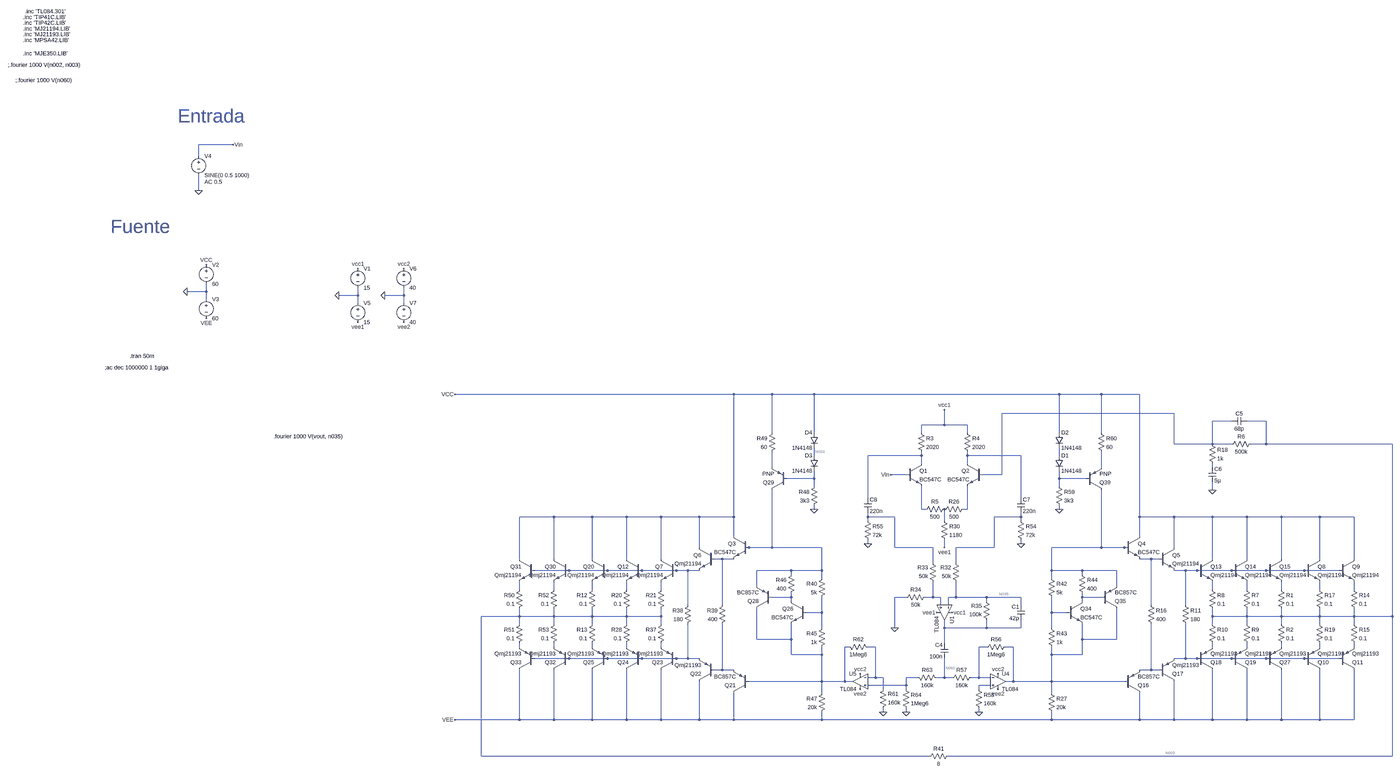
[diagram p0: schematic V4.asc, whole sheet]
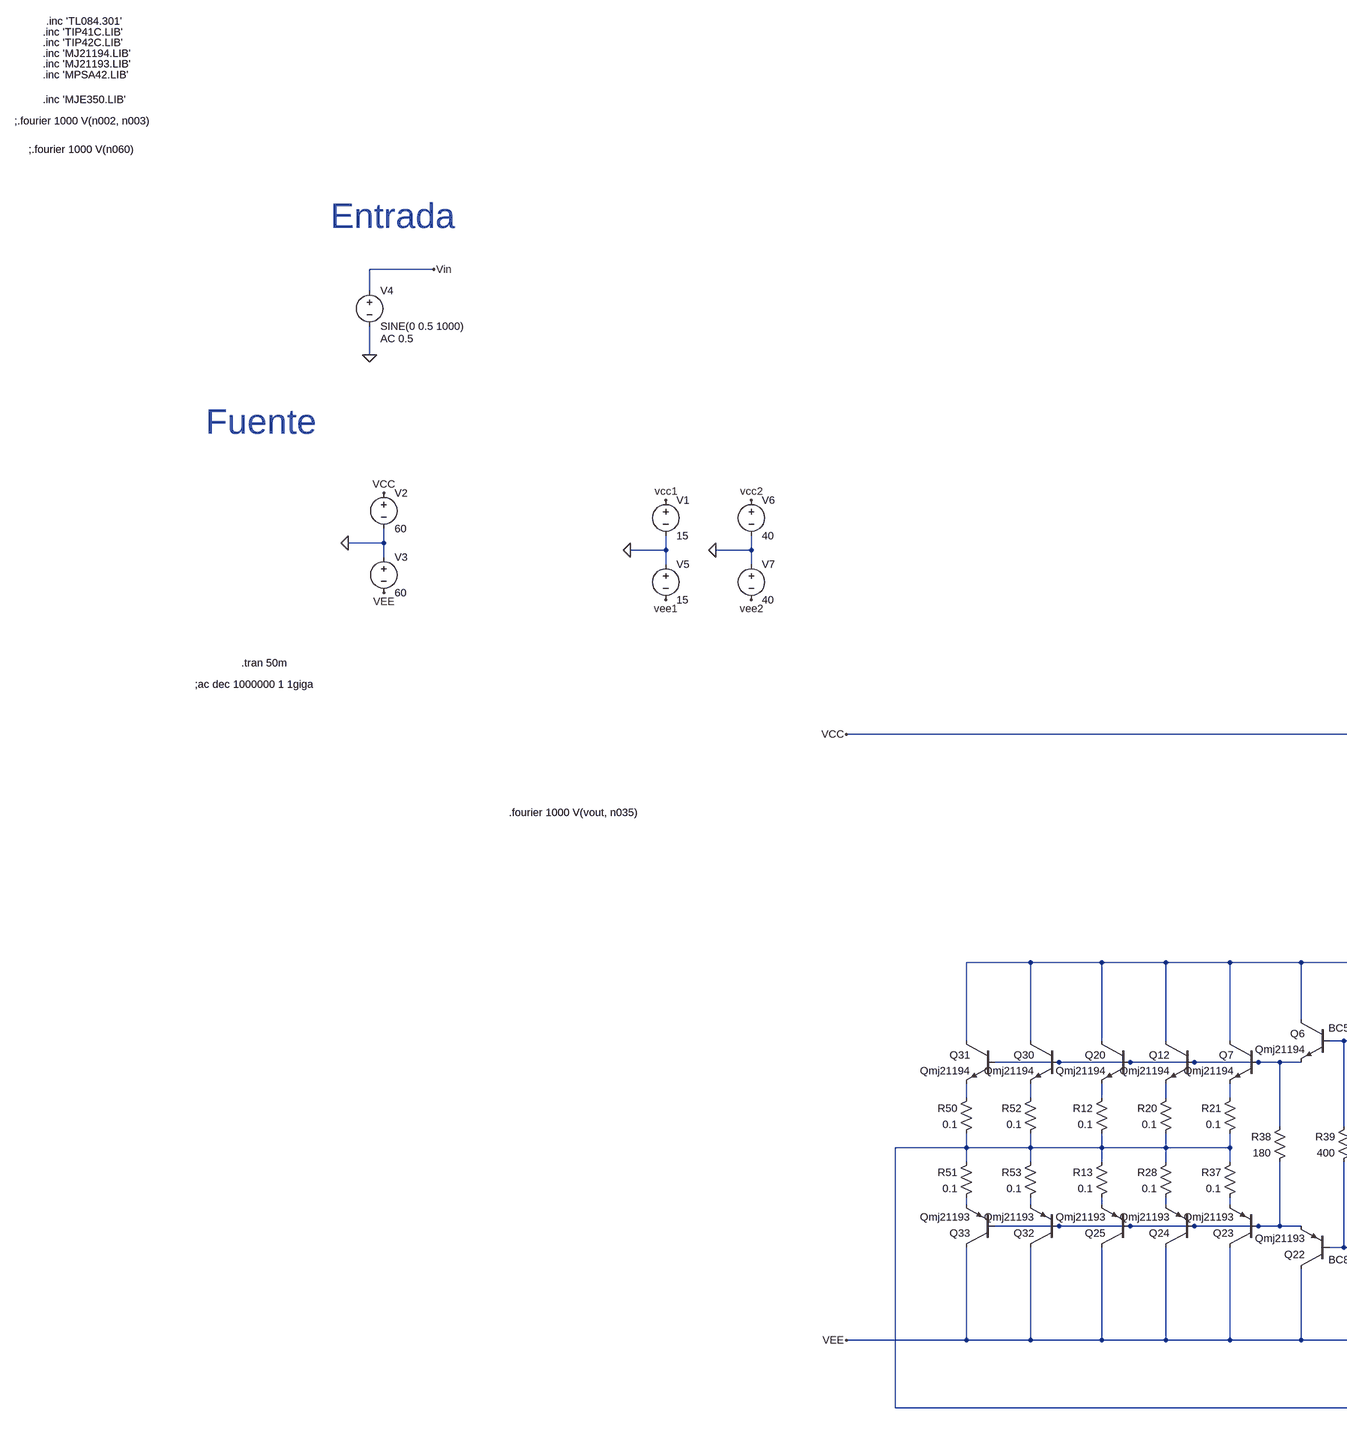
[diagram p1: schematic V4.asc, part, row 1 of 1, column 1 of 2]
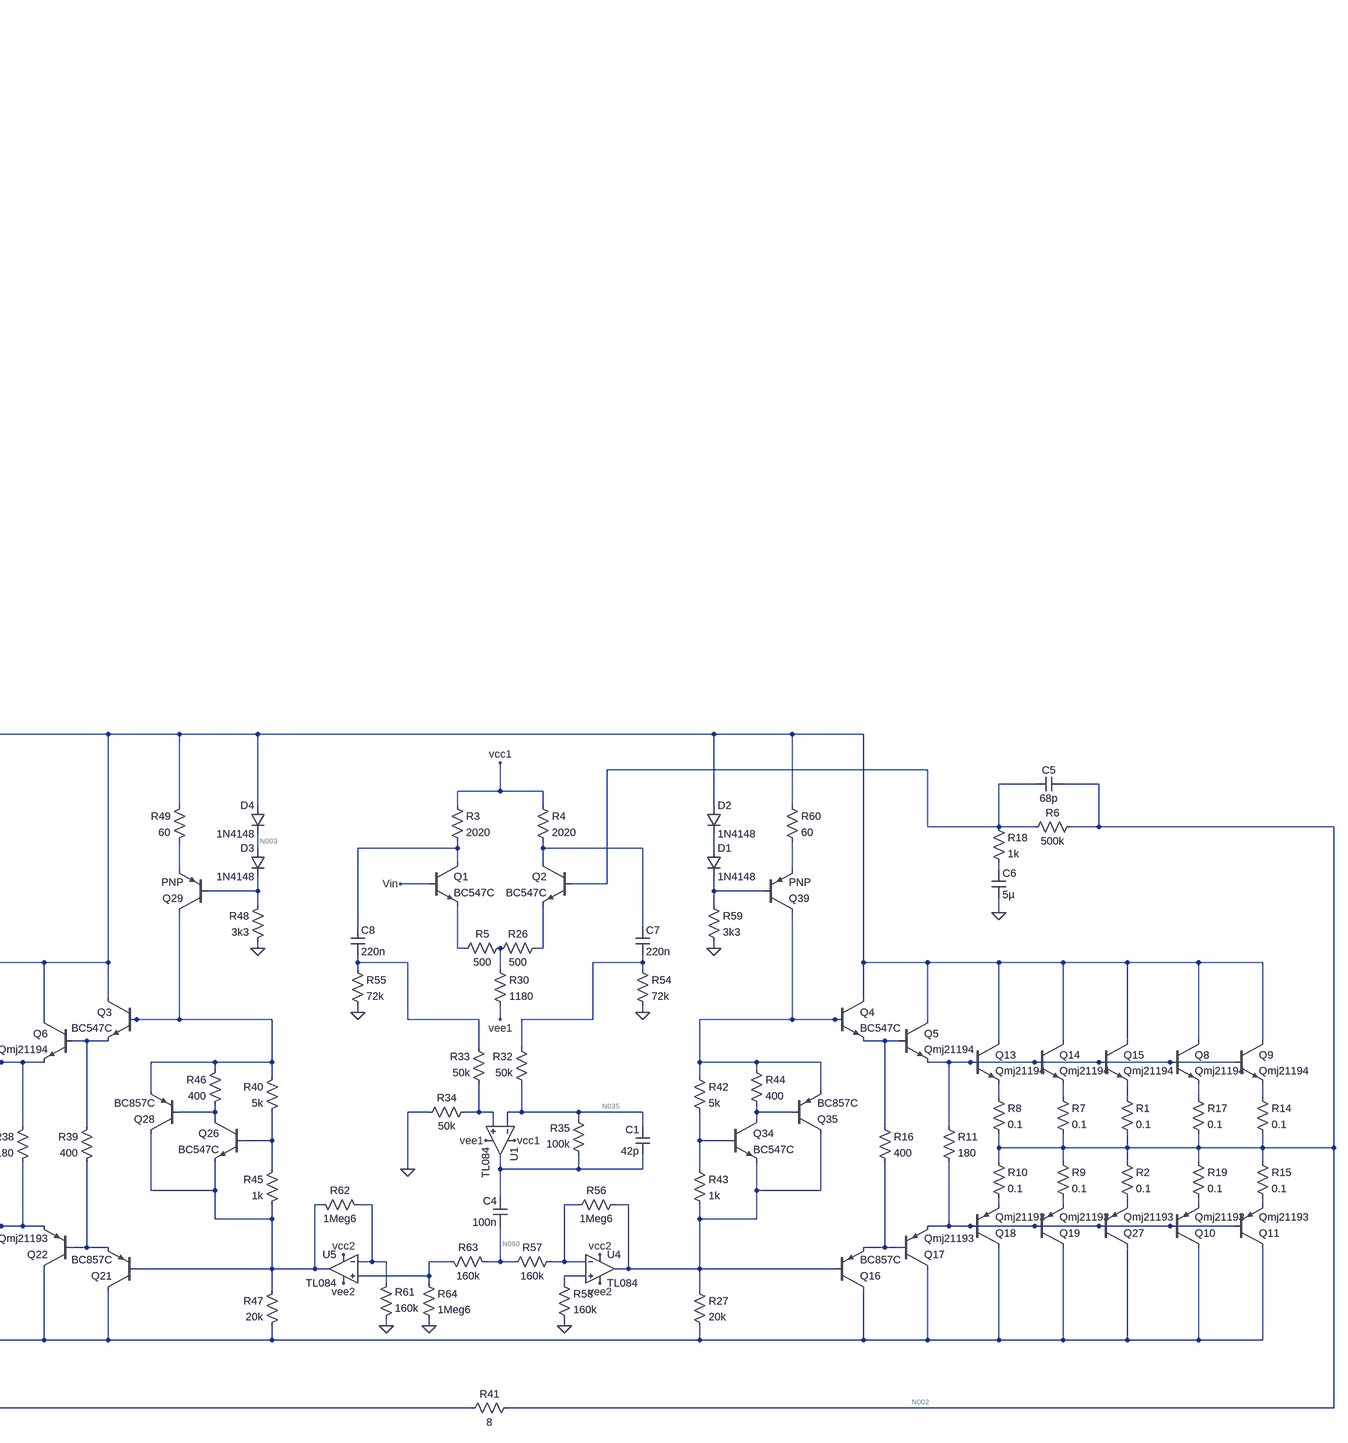
[diagram p2: schematic V4.asc, part, row 1 of 1, column 2 of 2]
V4.asc, the LTspice schematic file:
Version 4
SHEET 1 11584 4036
WIRE 3760 -64 3616 -64
WIRE 3616 -16 3616 -64
WIRE 3616 128 3616 64
WIRE 3648 1200 3648 1168
WIRE 3648 1200 3568 1200
WIRE 4288 1216 4288 1184
WIRE 4288 1216 4208 1216
WIRE 4480 1216 4480 1184
WIRE 4480 1216 4400 1216
WIRE 3648 1232 3648 1200
WIRE 4288 1248 4288 1216
WIRE 4480 1248 4480 1216
WIRE 6832 2000 5648 2000
WIRE 6992 2000 6832 2000
WIRE 7168 2000 6992 2000
WIRE 8192 2000 7168 2000
WIRE 8368 2000 8192 2000
WIRE 8528 2000 8368 2000
WIRE 8672 2080 7952 2080
WIRE 8912 2112 8832 2112
WIRE 9056 2112 8976 2112
WIRE 7712 2128 7712 2064
WIRE 7712 2128 7616 2128
WIRE 7808 2128 7712 2128
WIRE 6992 2160 6992 2000
WIRE 7168 2160 7168 2000
WIRE 7616 2160 7616 2128
WIRE 7808 2160 7808 2128
WIRE 8192 2160 8192 2000
WIRE 8368 2160 8368 2000
WIRE 8672 2208 8672 2080
WIRE 8832 2208 8832 2112
WIRE 8832 2208 8672 2208
WIRE 8912 2208 8832 2208
WIRE 9056 2208 9056 2112
WIRE 9056 2208 8992 2208
WIRE 9584 2208 9056 2208
WIRE 7168 2256 7168 2224
WIRE 7616 2256 7616 2240
WIRE 7616 2256 7392 2256
WIRE 7808 2256 7808 2240
WIRE 8032 2256 7808 2256
WIRE 8192 2256 8192 2224
WIRE 7616 2288 7616 2256
WIRE 7808 2288 7808 2256
WIRE 6992 2304 6992 2240
WIRE 8368 2304 8368 2240
WIRE 8832 2304 8832 2288
WIRE 7552 2336 7488 2336
WIRE 7952 2336 7952 2080
WIRE 7952 2336 7872 2336
WIRE 7168 2352 7168 2320
WIRE 7168 2352 7056 2352
WIRE 8192 2352 8192 2320
WIRE 8304 2352 8192 2352
WIRE 7168 2384 7168 2352
WIRE 8192 2384 8192 2352
WIRE 8832 2400 8832 2368
WIRE 7392 2432 7392 2256
WIRE 8032 2432 8032 2256
WIRE 7168 2480 7168 2464
WIRE 7616 2480 7616 2384
WIRE 7632 2480 7616 2480
WIRE 7808 2480 7808 2384
WIRE 7808 2480 7792 2480
WIRE 8192 2480 8192 2464
WIRE 6080 2512 5936 2512
WIRE 6240 2512 6080 2512
WIRE 6384 2512 6240 2512
WIRE 6528 2512 6384 2512
WIRE 6688 2512 6528 2512
WIRE 6832 2512 6832 2000
WIRE 6832 2512 6688 2512
WIRE 7392 2512 7392 2496
WIRE 7504 2512 7392 2512
WIRE 8032 2512 8032 2496
WIRE 8032 2512 7920 2512
WIRE 8528 2512 8528 2000
WIRE 8672 2512 8528 2512
WIRE 8832 2512 8672 2512
WIRE 8976 2512 8832 2512
WIRE 9120 2512 8976 2512
WIRE 9280 2512 9120 2512
WIRE 9424 2512 9280 2512
WIRE 7392 2528 7392 2512
WIRE 7712 2528 7712 2480
WIRE 8032 2528 8032 2512
WIRE 6832 2592 6832 2512
WIRE 8528 2592 8528 2512
WIRE 7392 2624 7392 2608
WIRE 8032 2624 8032 2608
WIRE 6688 2640 6688 2512
WIRE 6896 2640 6880 2640
WIRE 6992 2640 6992 2400
WIRE 6992 2640 6896 2640
WIRE 7200 2640 6992 2640
WIRE 7504 2640 7504 2512
WIRE 7664 2640 7504 2640
WIRE 7712 2640 7712 2608
WIRE 7920 2640 7920 2512
WIRE 7920 2640 7760 2640
WIRE 8368 2640 8368 2400
WIRE 8368 2640 8160 2640
WIRE 8464 2640 8368 2640
WIRE 8480 2640 8464 2640
WIRE 8672 2640 8672 2512
WIRE 5936 2688 5936 2512
WIRE 6080 2688 6080 2512
WIRE 6240 2688 6240 2512
WIRE 6384 2688 6384 2512
WIRE 6528 2688 6528 2512
WIRE 6784 2688 6752 2688
WIRE 6832 2688 6784 2688
WIRE 8576 2688 8528 2688
WIRE 8608 2688 8576 2688
WIRE 8832 2688 8832 2512
WIRE 8976 2688 8976 2512
WIRE 9120 2688 9120 2512
WIRE 9280 2688 9280 2512
WIRE 9424 2688 9424 2512
WIRE 7664 2704 7664 2640
WIRE 7760 2704 7760 2640
WIRE 6144 2736 6000 2736
WIRE 6304 2736 6144 2736
WIRE 6448 2736 6304 2736
WIRE 6592 2736 6448 2736
WIRE 6640 2736 6592 2736
WIRE 6688 2736 6640 2736
WIRE 7072 2736 6928 2736
WIRE 7200 2736 7200 2640
WIRE 7200 2736 7072 2736
WIRE 8160 2736 8160 2640
WIRE 8288 2736 8160 2736
WIRE 8432 2736 8288 2736
WIRE 8720 2736 8672 2736
WIRE 8768 2736 8720 2736
WIRE 8912 2736 8768 2736
WIRE 9056 2736 8912 2736
WIRE 9216 2736 9056 2736
WIRE 9360 2736 9216 2736
WIRE 7072 2752 7072 2736
WIRE 8288 2752 8288 2736
WIRE 7200 2768 7200 2736
WIRE 8160 2768 8160 2736
WIRE 6928 2800 6928 2736
WIRE 8432 2800 8432 2736
WIRE 5936 2816 5936 2784
WIRE 6080 2816 6080 2784
WIRE 6240 2816 6240 2784
WIRE 6384 2816 6384 2784
WIRE 6528 2816 6528 2784
WIRE 8832 2816 8832 2784
WIRE 8976 2816 8976 2784
WIRE 9120 2816 9120 2784
WIRE 9280 2816 9280 2784
WIRE 9424 2816 9424 2784
WIRE 7072 2848 7072 2832
WIRE 7072 2848 6992 2848
WIRE 7552 2848 7504 2848
WIRE 7664 2848 7664 2784
WIRE 7664 2848 7632 2848
WIRE 7696 2848 7664 2848
WIRE 7760 2848 7760 2784
WIRE 7760 2848 7728 2848
WIRE 7888 2848 7760 2848
WIRE 8032 2848 7888 2848
WIRE 8288 2848 8288 2832
WIRE 8368 2848 8288 2848
WIRE 7072 2864 7072 2848
WIRE 7888 2864 7888 2848
WIRE 8288 2864 8288 2848
WIRE 6640 2880 6640 2736
WIRE 6784 2880 6784 2688
WIRE 7696 2880 7696 2848
WIRE 7728 2880 7728 2848
WIRE 8032 2880 8032 2848
WIRE 8576 2880 8576 2688
WIRE 8720 2880 8720 2736
WIRE 7200 2912 7200 2848
WIRE 7200 2912 7136 2912
WIRE 8160 2912 8160 2848
WIRE 8224 2912 8160 2912
WIRE 5936 2928 5936 2896
WIRE 5936 2928 5776 2928
WIRE 6080 2928 6080 2896
WIRE 6080 2928 5936 2928
WIRE 6240 2928 6240 2896
WIRE 6240 2928 6080 2928
WIRE 6384 2928 6384 2896
WIRE 6384 2928 6240 2928
WIRE 6528 2928 6528 2896
WIRE 6528 2928 6384 2928
WIRE 8832 2928 8832 2896
WIRE 8976 2928 8976 2896
WIRE 8976 2928 8832 2928
WIRE 9120 2928 9120 2896
WIRE 9120 2928 8976 2928
WIRE 9280 2928 9280 2896
WIRE 9280 2928 9120 2928
WIRE 9424 2928 9424 2896
WIRE 9424 2928 9280 2928
WIRE 9584 2928 9584 2208
WIRE 9584 2928 9424 2928
WIRE 5936 2960 5936 2928
WIRE 6080 2960 6080 2928
WIRE 6240 2960 6240 2928
WIRE 6384 2960 6384 2928
WIRE 6528 2960 6528 2928
WIRE 8832 2960 8832 2928
WIRE 8976 2960 8976 2928
WIRE 9120 2960 9120 2928
WIRE 9280 2960 9280 2928
WIRE 9424 2960 9424 2928
WIRE 7200 2976 7200 2912
WIRE 7504 2976 7504 2848
WIRE 7712 2976 7712 2944
WIRE 7888 2976 7888 2944
WIRE 7888 2976 7712 2976
WIRE 8032 2976 8032 2944
WIRE 8032 2976 7888 2976
WIRE 8160 2976 8160 2912
WIRE 6928 3024 6928 2896
WIRE 7072 3024 7072 2960
WIRE 7072 3024 6928 3024
WIRE 8288 3024 8288 2960
WIRE 8432 3024 8432 2896
WIRE 8432 3024 8288 3024
WIRE 7712 3040 7712 2976
WIRE 5936 3056 5936 3040
WIRE 6080 3056 6080 3040
WIRE 6240 3056 6240 3040
WIRE 6384 3056 6384 3040
WIRE 6528 3056 6528 3040
WIRE 7312 3056 7296 3056
WIRE 7424 3056 7392 3056
WIRE 7888 3056 7856 3056
WIRE 8000 3056 7968 3056
WIRE 8832 3056 8832 3040
WIRE 8976 3056 8976 3040
WIRE 9120 3056 9120 3040
WIRE 9280 3056 9280 3040
WIRE 9424 3056 9424 3040
WIRE 7072 3088 7072 3024
WIRE 7200 3088 7200 3056
WIRE 7200 3088 7072 3088
WIRE 8160 3088 8160 3056
WIRE 8288 3088 8288 3024
WIRE 8288 3088 8160 3088
WIRE 6144 3104 6000 3104
WIRE 6304 3104 6144 3104
WIRE 6448 3104 6304 3104
WIRE 6592 3104 6448 3104
WIRE 6640 3104 6640 2960
WIRE 6640 3104 6592 3104
WIRE 6688 3104 6640 3104
WIRE 8720 3104 8720 2960
WIRE 8720 3104 8672 3104
WIRE 8768 3104 8720 3104
WIRE 8912 3104 8768 3104
WIRE 9056 3104 8912 3104
WIRE 9216 3104 9056 3104
WIRE 9360 3104 9216 3104
WIRE 6784 3152 6784 2960
WIRE 6784 3152 6752 3152
WIRE 6832 3152 6784 3152
WIRE 8576 3152 8576 2960
WIRE 8576 3152 8528 3152
WIRE 8608 3152 8576 3152
WIRE 7424 3184 7424 3056
WIRE 7424 3184 7392 3184
WIRE 7456 3184 7424 3184
WIRE 7600 3184 7552 3184
WIRE 7712 3184 7712 3104
WIRE 7712 3184 7680 3184
WIRE 7744 3184 7712 3184
WIRE 7856 3184 7856 3056
WIRE 7856 3184 7824 3184
WIRE 7904 3184 7856 3184
WIRE 7200 3200 7200 3088
WIRE 7200 3200 6896 3200
WIRE 7296 3200 7296 3056
WIRE 7296 3200 7200 3200
WIRE 7328 3200 7296 3200
WIRE 8000 3200 8000 3056
WIRE 8000 3200 7968 3200
WIRE 8160 3200 8160 3088
WIRE 8160 3200 8000 3200
WIRE 8464 3200 8160 3200
WIRE 7552 3216 7552 3184
WIRE 7552 3216 7392 3216
WIRE 7904 3216 7856 3216
WIRE 7456 3232 7456 3184
WIRE 7552 3232 7552 3216
WIRE 7856 3232 7856 3216
WIRE 7200 3248 7200 3200
WIRE 8160 3248 8160 3200
WIRE 7456 3328 7456 3312
WIRE 7552 3328 7552 3312
WIRE 7856 3328 7856 3312
WIRE 5936 3360 5936 3152
WIRE 5936 3360 5648 3360
WIRE 6080 3360 6080 3152
WIRE 6080 3360 5936 3360
WIRE 6240 3360 6240 3152
WIRE 6240 3360 6080 3360
WIRE 6384 3360 6384 3152
WIRE 6384 3360 6240 3360
WIRE 6528 3360 6528 3152
WIRE 6528 3360 6384 3360
WIRE 6688 3360 6688 3200
WIRE 6688 3360 6528 3360
WIRE 6832 3360 6832 3248
WIRE 6832 3360 6688 3360
WIRE 7200 3360 7200 3328
WIRE 7200 3360 6832 3360
WIRE 8160 3360 8160 3328
WIRE 8160 3360 7200 3360
WIRE 8528 3360 8528 3248
WIRE 8528 3360 8160 3360
WIRE 8672 3360 8672 3200
WIRE 8672 3360 8528 3360
WIRE 8832 3360 8832 3152
WIRE 8832 3360 8672 3360
WIRE 8976 3360 8976 3152
WIRE 8976 3360 8832 3360
WIRE 9120 3360 9120 3152
WIRE 9120 3360 8976 3360
WIRE 9280 3360 9280 3152
WIRE 9280 3360 9120 3360
WIRE 9424 3360 9424 3152
WIRE 9424 3360 9280 3360
WIRE 5776 3536 5776 2928
WIRE 7648 3536 5776 3536
WIRE 9584 3536 9584 2928
WIRE 9584 3536 7728 3536
FLAG 3568 1200 0
FLAG 3616 128 0
FLAG 3760 -64 Vin
FLAG 3648 1088 VCC
FLAG 3648 1312 VEE
FLAG 7488 2336 Vin
FLAG 4208 1216 0
FLAG 4288 1104 vcc1
FLAG 4288 1328 vee1
FLAG 7712 2640 vee1
FLAG 7680 2912 vee1
FLAG 7712 2064 vcc1
FLAG 7744 2912 vcc1
FLAG 4400 1216 0
FLAG 4480 1104 vcc2
FLAG 4480 1328 vee2
FLAG 8192 2480 0
FLAG 7168 2480 0
FLAG 5648 3360 VEE
FLAG 5648 2000 VCC
FLAG 8032 2624 0
FLAG 7392 2624 0
FLAG 7504 2976 0
FLAG 7856 3328 0
FLAG 7936 3232 vee2
FLAG 7936 3168 vcc2
FLAG 7456 3328 0
FLAG 7360 3232 vee2
FLAG 7360 3168 vcc2
FLAG 7552 3328 0
FLAG 8832 2400 0
SYMBOL npn 8464 2592 R0
SYMATTR InstName Q4
SYMATTR Value BC547C
SYMBOL npn 8608 2640 R0
SYMATTR InstName Q5
SYMATTR Value Qmj21194
SYMBOL npn 8768 2688 R0
SYMATTR InstName Q13
SYMATTR Value Qmj21194
SYMBOL npn 8912 2688 R0
SYMATTR InstName Q14
SYMATTR Value Qmj21194
SYMBOL npn 9056 2688 R0
SYMATTR InstName Q15
SYMATTR Value Qmj21194
SYMBOL pnp 8464 3248 M180
SYMATTR InstName Q16
SYMATTR Value BC857C
SYMBOL pnp 8608 3200 M180
SYMATTR InstName Q17
SYMATTR Value Qmj21193
SYMBOL pnp 8768 3152 M180
SYMATTR InstName Q18
SYMATTR Value Qmj21193
SYMBOL pnp 8912 3152 M180
SYMATTR InstName Q19
SYMATTR Value Qmj21193
SYMBOL pnp 9056 3152 M180
SYMATTR InstName Q27
SYMATTR Value Qmj21193
SYMBOL res 9104 2800 R0
SYMATTR InstName R1
SYMATTR Value 0.1
SYMBOL res 9104 2944 R0
SYMATTR InstName R2
SYMATTR Value 0.1
SYMBOL res 8960 2800 R0
SYMATTR InstName R7
SYMATTR Value 0.1
SYMBOL res 8816 2800 R0
SYMATTR InstName R8
SYMATTR Value 0.1
SYMBOL res 8960 2944 R0
SYMATTR InstName R9
SYMATTR Value 0.1
SYMBOL res 8816 2944 R0
SYMATTR InstName R10
SYMATTR Value 0.1
SYMBOL res 8704 2864 R0
SYMATTR InstName R11
SYMATTR Value 180
SYMBOL res 8560 2864 R0
SYMATTR InstName R16
SYMATTR Value 400
SYMBOL npn 8224 2864 R0
SYMATTR InstName Q34
SYMATTR Value BC547C
SYMBOL res 8144 2752 R0
SYMATTR InstName R42
SYMATTR Value 5k
SYMBOL res 8144 2960 R0
SYMATTR InstName R43
SYMATTR Value 1k
SYMBOL res 8272 2736 R0
SYMATTR InstName R44
SYMATTR Value 400
SYMBOL pnp 8368 2896 M180
SYMATTR InstName Q35
SYMATTR Value BC857C
SYMBOL voltage 3648 1072 R0
WINDOW 123 0 0 Left 0
WINDOW 39 24 44 Left 2
SYMATTR InstName V2
SYMATTR Value 60
SYMBOL voltage 3648 1216 R0
WINDOW 123 0 0 Left 0
WINDOW 39 24 124 Left 2
SYMATTR InstName V3
SYMATTR Value 60
SYMBOL voltage 3616 -32 R0
WINDOW 123 24 124 Left 2
WINDOW 39 0 0 Left 0
SYMATTR Value2 AC 0.5
SYMATTR InstName V4
SYMATTR Value SINE(0 0.5 1000)
SYMBOL voltage 4288 1088 R0
WINDOW 123 0 0 Left 0
WINDOW 39 24 44 Left 2
SYMATTR InstName V1
SYMATTR Value 15
SYMBOL voltage 4288 1232 R0
WINDOW 123 0 0 Left 0
WINDOW 39 24 124 Left 2
SYMATTR InstName V5
SYMATTR Value 15
SYMBOL npn 7552 2288 R0
SYMATTR InstName Q1
SYMATTR Value BC547C
SYMBOL npn 7872 2288 M0
SYMATTR InstName Q2
SYMATTR Value BC547C
SYMBOL res 7600 2144 R0
SYMATTR InstName R3
SYMATTR Value 2020
SYMBOL res 7792 2144 R0
SYMATTR InstName R4
SYMATTR Value 2020
SYMBOL res 7728 2464 R90
WINDOW 0 0 56 VBottom 2
WINDOW 3 32 56 VTop 2
SYMATTR InstName R5
SYMATTR Value 500
SYMBOL res 7808 2464 R90
WINDOW 0 0 56 VBottom 2
WINDOW 3 32 56 VTop 2
SYMATTR InstName R26
SYMATTR Value 500
SYMBOL res 7696 2512 R0
SYMATTR InstName R30
SYMATTR Value 1180
SYMBOL Opamps\\opamp2 7776 2912 R90
SYMATTR InstName U1
SYMATTR Value TL084
SYMBOL res 7776 2800 R180
WINDOW 0 36 76 Left 2
WINDOW 3 36 40 Left 2
SYMATTR InstName R32
SYMATTR Value 50k
SYMBOL res 7680 2800 R180
WINDOW 0 36 76 Left 2
WINDOW 3 36 40 Left 2
SYMATTR InstName R33
SYMATTR Value 50k
SYMBOL res 7648 2832 R90
WINDOW 0 0 56 VBottom 2
WINDOW 3 32 56 VTop 2
SYMATTR InstName R34
SYMATTR Value 50k
SYMBOL res 7904 2960 R180
WINDOW 0 36 76 Left 2
WINDOW 3 36 40 Left 2
SYMATTR InstName R35
SYMATTR Value 100k
SYMBOL cap 8048 2944 R180
WINDOW 0 24 56 Left 2
WINDOW 3 24 8 Left 2
SYMATTR InstName C1
SYMATTR Value 42p
SYMBOL voltage 4480 1088 R0
WINDOW 123 0 0 Left 0
WINDOW 39 24 44 Left 2
SYMATTR InstName V6
SYMATTR Value 40
SYMBOL voltage 4480 1232 R0
WINDOW 123 0 0 Left 0
WINDOW 39 24 124 Left 2
SYMATTR InstName V7
SYMATTR Value 40
SYMBOL res 8144 3232 R0
SYMATTR InstName R27
SYMATTR Value 20k
SYMBOL pnp 8304 2400 M180
SYMATTR InstName Q39
SYMBOL res 8176 2368 R0
SYMATTR InstName R59
SYMATTR Value 3k3
SYMBOL diode 8176 2256 R0
SYMATTR InstName D1
SYMATTR Value 1N4148
SYMBOL diode 8176 2160 R0
SYMATTR InstName D2
SYMATTR Value 1N4148
SYMBOL res 8352 2144 R0
SYMATTR InstName R60
SYMATTR Value 60
SYMBOL npn 9216 2688 R0
SYMATTR InstName Q8
SYMATTR Value Qmj21194
SYMBOL npn 9360 2688 R0
SYMATTR InstName Q9
SYMATTR Value Qmj21194
SYMBOL pnp 9216 3152 M180
SYMATTR InstName Q10
SYMATTR Value Qmj21193
SYMBOL pnp 9360 3152 M180
SYMATTR InstName Q11
SYMATTR Value Qmj21193
SYMBOL res 9408 2800 R0
SYMATTR InstName R14
SYMATTR Value 0.1
SYMBOL res 9408 2944 R0
SYMATTR InstName R15
SYMATTR Value 0.1
SYMBOL res 9264 2800 R0
SYMATTR InstName R17
SYMATTR Value 0.1
SYMBOL res 9264 2944 R0
SYMATTR InstName R19
SYMATTR Value 0.1
SYMBOL npn 6896 2592 M0
SYMATTR InstName Q3
SYMATTR Value BC547C
SYMBOL npn 6752 2640 M0
SYMATTR InstName Q6
SYMATTR Value Qmj21194
SYMBOL npn 6592 2688 M0
SYMATTR InstName Q7
SYMATTR Value Qmj21194
SYMBOL npn 6448 2688 M0
SYMATTR InstName Q12
SYMATTR Value Qmj21194
SYMBOL npn 6304 2688 M0
SYMATTR InstName Q20
SYMATTR Value Qmj21194
SYMBOL pnp 6896 3248 R180
SYMATTR InstName Q21
SYMATTR Value BC857C
SYMBOL pnp 6752 3200 R180
SYMATTR InstName Q22
SYMATTR Value Qmj21193
SYMBOL pnp 6592 3152 R180
SYMATTR InstName Q23
SYMATTR Value Qmj21193
SYMBOL pnp 6448 3152 R180
SYMATTR InstName Q24
SYMATTR Value Qmj21193
SYMBOL pnp 6304 3152 R180
SYMATTR InstName Q25
SYMATTR Value Qmj21193
SYMBOL res 6256 2800 M0
SYMATTR InstName R12
SYMATTR Value 0.1
SYMBOL res 6256 2944 M0
SYMATTR InstName R13
SYMATTR Value 0.1
SYMBOL res 6400 2800 M0
SYMATTR InstName R20
SYMATTR Value 0.1
SYMBOL res 6544 2800 M0
SYMATTR InstName R21
SYMATTR Value 0.1
SYMBOL res 6400 2944 M0
SYMATTR InstName R28
SYMATTR Value 0.1
SYMBOL res 6544 2944 M0
SYMATTR InstName R37
SYMATTR Value 0.1
SYMBOL res 6656 2864 M0
SYMATTR InstName R38
SYMATTR Value 180
SYMBOL res 6800 2864 M0
SYMATTR InstName R39
SYMATTR Value 400
SYMBOL npn 7136 2864 M0
SYMATTR InstName Q26
SYMATTR Value BC547C
SYMBOL res 7216 2752 M0
SYMATTR InstName R40
SYMATTR Value 5k
SYMBOL res 7216 2960 M0
SYMATTR InstName R45
SYMATTR Value 1k
SYMBOL res 7088 2736 M0
SYMATTR InstName R46
SYMATTR Value 400
SYMBOL pnp 6992 2896 R180
SYMATTR InstName Q28
SYMATTR Value BC857C
SYMBOL res 7216 3232 M0
SYMATTR InstName R47
SYMATTR Value 20k
SYMBOL pnp 7056 2400 R180
SYMATTR InstName Q29
SYMBOL res 7184 2368 M0
SYMATTR InstName R48
SYMATTR Value 3k3
SYMBOL diode 7184 2256 M0
SYMATTR InstName D3
SYMATTR Value 1N4148
SYMBOL diode 7184 2160 M0
SYMATTR InstName D4
SYMATTR Value 1N4148
SYMBOL res 7008 2144 M0
SYMATTR InstName R49
SYMATTR Value 60
SYMBOL npn 6144 2688 M0
SYMATTR InstName Q30
SYMATTR Value Qmj21194
SYMBOL npn 6000 2688 M0
SYMATTR InstName Q31
SYMATTR Value Qmj21194
SYMBOL pnp 6144 3152 R180
SYMATTR InstName Q32
SYMATTR Value Qmj21193
SYMBOL pnp 6000 3152 R180
SYMATTR InstName Q33
SYMATTR Value Qmj21193
SYMBOL res 5952 2800 M0
SYMATTR InstName R50
SYMATTR Value 0.1
SYMBOL res 5952 2944 M0
SYMATTR InstName R51
SYMATTR Value 0.1
SYMBOL res 6096 2800 M0
SYMATTR InstName R52
SYMATTR Value 0.1
SYMBOL res 6096 2944 M0
SYMATTR InstName R53
SYMATTR Value 0.1
SYMBOL res 7744 3520 R90
WINDOW 0 0 56 VBottom 2
WINDOW 3 32 56 VTop 2
SYMATTR InstName R41
SYMATTR Value 8
SYMBOL cap 8016 2432 R0
SYMATTR InstName C7
SYMATTR Value 220n
SYMBOL res 8016 2512 R0
SYMATTR InstName R54
SYMATTR Value 72k
SYMBOL cap 7376 2432 R0
SYMATTR InstName C8
SYMATTR Value 220n
SYMBOL res 7376 2512 R0
SYMATTR InstName R55
SYMATTR Value 72k
SYMBOL cap 7728 3104 R180
WINDOW 0 24 56 Left 2
WINDOW 3 24 8 Left 2
SYMATTR InstName C4
SYMATTR Value 100n
SYMBOL Opamps\\opamp2 7936 3136 R0
SYMATTR InstName U4
SYMATTR Value TL084
SYMBOL res 7984 3040 R90
WINDOW 0 0 56 VBottom 2
WINDOW 3 32 56 VTop 2
SYMATTR InstName R56
SYMATTR Value 1Meg6
SYMBOL res 7840 3168 R90
WINDOW 0 0 56 VBottom 2
WINDOW 3 32 56 VTop 2
SYMATTR InstName R57
SYMATTR Value 160k
SYMBOL res 7840 3216 R0
SYMATTR InstName R58
SYMATTR Value 160k
SYMBOL Opamps\\opamp2 7360 3136 M0
SYMATTR InstName U5
SYMATTR Value TL084
SYMBOL res 7440 3328 M180
WINDOW 0 36 76 Left 2
WINDOW 3 36 40 Left 2
SYMATTR InstName R61
SYMATTR Value 160k
SYMBOL res 7296 3040 M90
WINDOW 0 0 56 VBottom 2
WINDOW 3 32 56 VTop 2
SYMATTR InstName R62
SYMATTR Value 1Meg6
SYMBOL res 7696 3200 M270
WINDOW 0 32 56 VTop 2
WINDOW 3 0 56 VBottom 2
SYMATTR InstName R63
SYMATTR Value 160k
SYMBOL res 7536 3216 R0
SYMATTR InstName R64
SYMATTR Value 1Meg6
SYMBOL res 9008 2192 R90
WINDOW 0 0 56 VBottom 2
WINDOW 3 32 56 VTop 2
SYMATTR InstName R6
SYMATTR Value 500k
SYMBOL res 8816 2192 R0
SYMATTR InstName R18
SYMATTR Value 1k
SYMBOL cap 8976 2096 R90
WINDOW 0 0 32 VBottom 2
WINDOW 3 32 32 VTop 2
SYMATTR InstName C5
SYMATTR Value 68p
SYMBOL cap 8816 2304 R0
SYMATTR InstName C6
SYMATTR Value 5µ
TEXT -568 -744 Left 2 !.inc 'TL084.301'
TEXT -576 -720 Left 2 !.inc 'TIP41C.LIB'
TEXT -640 -520 Left 2 !;.fourier 1000 V(n002, n003)
TEXT 3328 1840 Left 2 !.tran 50m
TEXT -576 -696 Left 2 !.inc 'TIP42C.LIB'
TEXT -576 -672 Left 2 !.inc 'MJ21194.LIB'
TEXT -576 -648 Left 2 !.inc 'MJ21193.LIB'
TEXT -576 -624 Left 2 !.inc 'MPSA42.LIB'
TEXT -576 -568 Left 2 !.inc 'MJE350.LIB'
TEXT -608 -456 Left 2 !;.fourier 1000 V(n060)
TEXT 3248 840 Left 6 ;Fuente
TEXT 3528 -184 Left 6 ;Entrada
TEXT 3224 1888 Left 2 !;ac dec 1000000 1 1giga
TEXT 3936 2176 Left 2 !.fourier 1000 V(vout, n035)

The netlist it stands for:
* V4.asc
Q4 VCC N018 N020 0 BC547C
Q5 VCC N020 N022 0 Qmj21194
Q13 VCC N022 N028 0 Qmj21194
Q14 VCC N022 N029 0 Qmj21194
Q15 VCC N022 N030 0 Qmj21194
Q16 VEE N042 N058 0 BC857C
Q17 VEE N058 N056 0 Qmj21193
Q18 VEE N056 N050 0 Qmj21193
Q19 VEE N056 N051 0 Qmj21193
Q27 VEE N056 N052 0 Qmj21193
R1 N030 N002 0.1
R2 N002 N052 0.1
R7 N029 N002 0.1
R8 N028 N002 0.1
R9 N002 N051 0.1
R10 N002 N050 0.1
R11 N022 N056 180
R16 N020 N058 400
Q34 N036 N038 N042 0 BC547C
R42 N018 N038 5k
R43 N038 N042 1k
R44 N018 N036 400
Q35 N042 N036 N018 0 BC857C
V2 VCC 0 60
V3 0 VEE 60
V4 Vin 0 SINE(0 0.5 1000) AC 0.5
V1 vcc1 0 15
V5 0 vee1 15
Q1 N004 Vin N012 0 BC547C
Q2 N005 N001 N013 0 BC547C
R3 vcc1 N004 2020
R4 vcc1 N005 2020
R5 N016 N012 500
R26 N013 N016 500
R30 N016 vee1 1180
XU1 N034 N035 vcc1 vee1 N040 TL084  ; pins In+ In- V+ V- OUT
R32 N035 N015 50k
R33 N034 N014 50k
R34 N034 0 50k
R35 N040 N035 100k
C1 N040 N035 42p
V6 vcc2 0 40
V7 0 vee2 40
R27 N042 VEE 20k
Q39 N018 N011 N008 0 PNP
R59 N011 0 3k3
D1 N006 N011 1N4148
D2 VCC N006 1N4148
R60 VCC N008 60
Q8 VCC N022 N031 0 Qmj21194
Q9 VCC N022 N032 0 Qmj21194
Q10 VEE N056 N053 0 Qmj21193
Q11 VEE N056 N054 0 Qmj21193
R14 N032 N002 0.1
R15 N002 N054 0.1
R17 N031 N002 0.1
R19 N002 N053 0.1
Q3 VCC N017 N019 0 BC547C
Q6 VCC N019 N021 0 Qmj21194
Q7 VCC N021 N027 0 Qmj21194
Q12 VCC N021 N026 0 Qmj21194
Q20 VCC N021 N025 0 Qmj21194
Q21 VEE N041 N057 0 BC857C
Q22 VEE N057 N055 0 Qmj21193
Q23 VEE N055 N047 0 Qmj21193
Q24 VEE N055 N046 0 Qmj21193
Q25 VEE N055 N045 0 Qmj21193
R12 N025 N039 0.1
R13 N039 N045 0.1
R20 N026 N039 0.1
R21 N027 N039 0.1
R28 N039 N046 0.1
R37 N039 N047 0.1
R38 N021 N055 180
R39 N019 N057 400
Q26 N033 N037 N041 0 BC547C
R40 N017 N037 5k
R45 N037 N041 1k
R46 N017 N033 400
Q28 N041 N033 N017 0 BC857C
R47 N041 VEE 20k
Q29 N017 N010 N007 0 PNP
R48 N010 0 3k3
D3 N003 N010 1N4148
D4 VCC N003 1N4148
R49 VCC N007 60
Q30 VCC N021 N024 0 Qmj21194
Q31 VCC N021 N023 0 Qmj21194
Q32 VEE N055 N044 0 Qmj21193
Q33 VEE N055 N043 0 Qmj21193
R50 N023 N039 0.1
R51 N039 N043 0.1
R52 N024 N039 0.1
R53 N039 N044 0.1
R41 N002 N039 8
C7 N005 N015 220n
R54 N015 0 72k
C8 N004 N014 220n
R55 N014 0 72k
C4 N060 N040 100n
XU4 N061 N049 vcc2 vee2 N042 TL084  ; pins In+ In- V+ V- OUT
R56 N042 N049 1Meg6
R57 N049 N060 160k
R58 N061 0 160k
XU5 N059 N048 vcc2 vee2 N041 TL084  ; pins In+ In- V+ V- OUT
R61 0 N048 160k
R62 N041 N048 1Meg6
R63 N060 N059 160k
R64 N059 0 1Meg6
R6 N002 N001 500k
R18 N001 N009 1k
C5 N002 N001 68p
C6 N009 0 5µ
.model D D
.lib standard.dio
.model NPN NPN
.model PNP PNP
.lib standard.bjt
.inc 'TL084.301'
.inc 'TIP41C.LIB'
;.fourier 1000 V(n002, n003)
.tran 50m
.inc 'TIP42C.LIB'
.inc 'MJ21194.LIB'
.inc 'MJ21193.LIB'
.inc 'MPSA42.LIB'
.inc 'MJE350.LIB'
;.fourier 1000 V(n060)
* Fuente
* Entrada
;ac dec 1000000 1 1giga
.fourier 1000 V(vout, n035)
.backanno
.end